# EasyEDA Pro project ProPrj_大功率电调_2026-08-17.epro, board 大功率电调V1.2
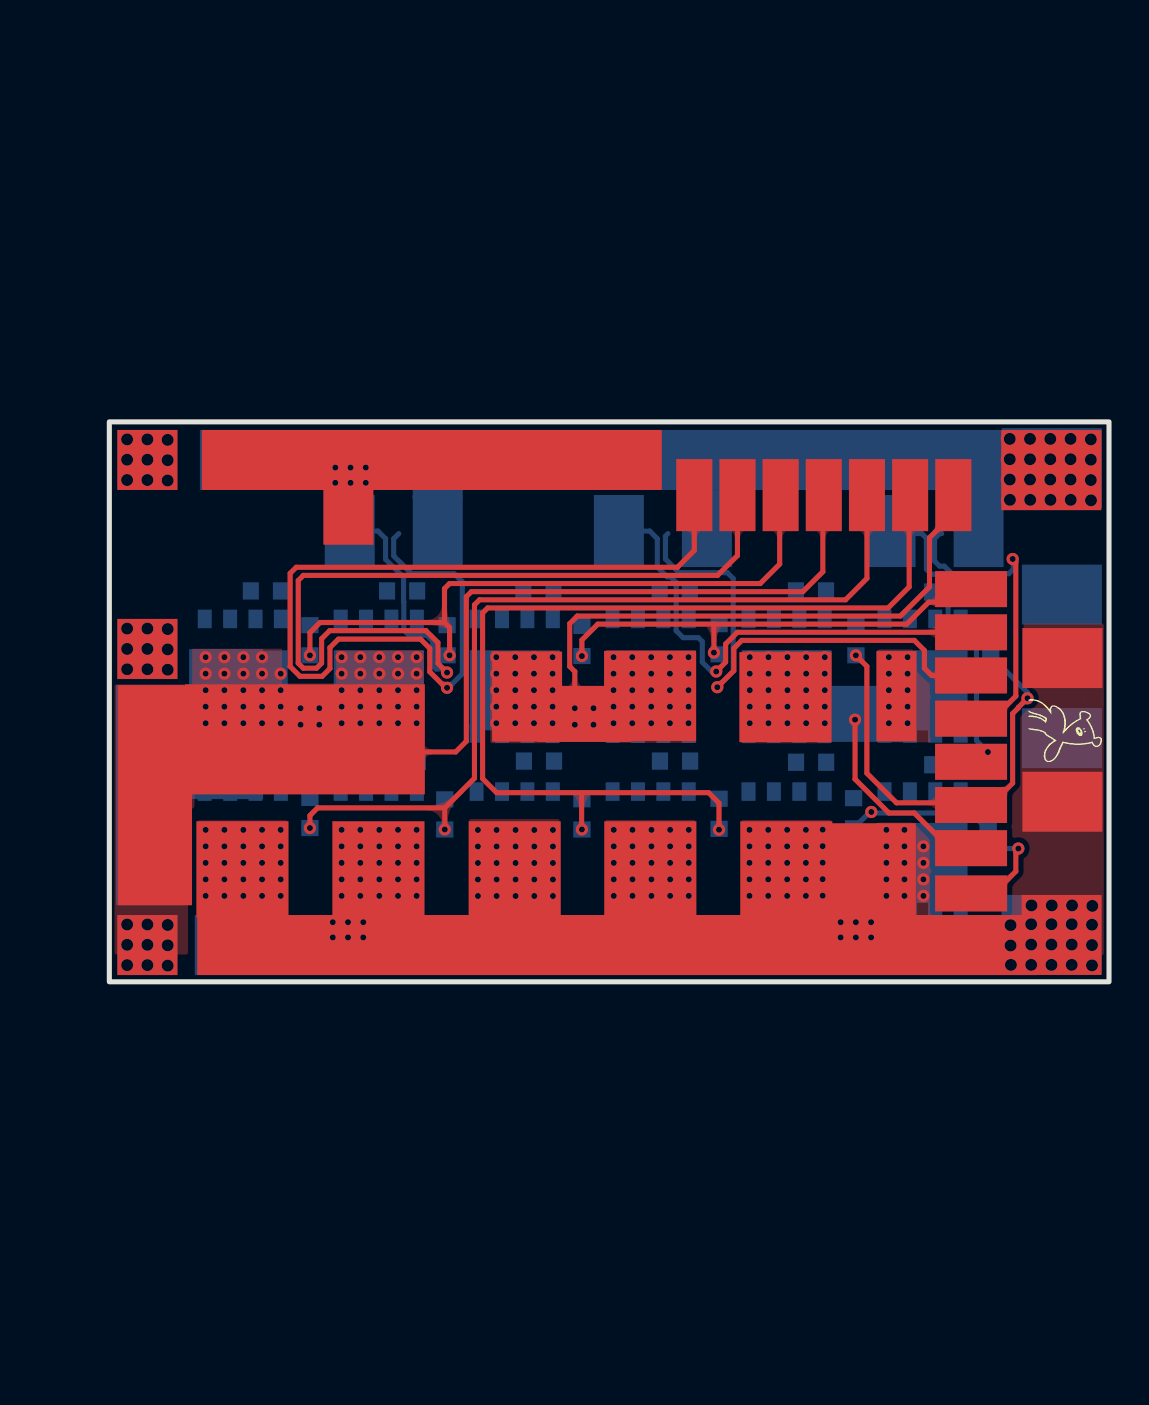
[diagram p17: board, top side]
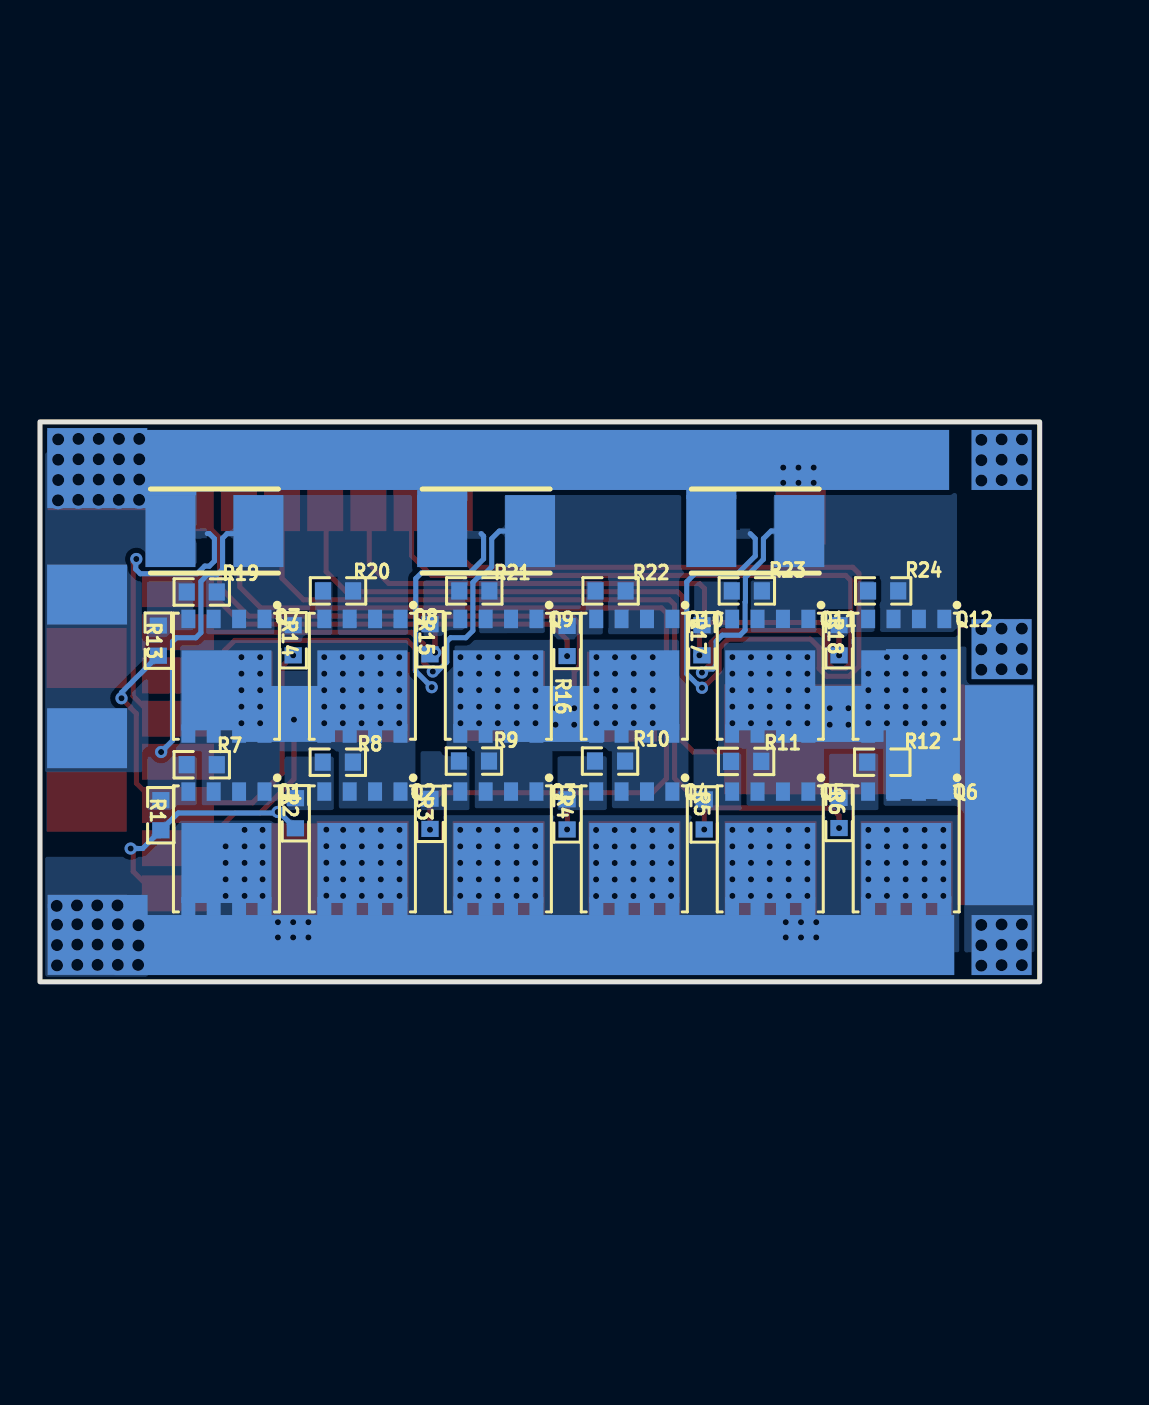
[diagram p18: board, bottom side, seen from below]

Outline 50 x 28 mm; copper layers: Top Layer, Inner1, Inner2, Bottom Layer. Coordinates in mm from the lower left corner of the outline.
Outline path: rectangle 50,28 0,0
Stack: Top Layer 0.035mm Outer layer thickness 1oz / Dielectric1 0.2104mm 7628 RC49% 8.6mil / Inner1 0.0152mm Inner layer thickness / Dielectric2 1.065mm 1.1mm H/HOZ Copper / Inner2 0.0152mm Inner layer thickness / Dielectric3 0.2104mm 7628 RC49% 8.6mil / Bottom Layer 0.035mm Outer layer thickness 1oz

## Design rules (mm)
spacing copperThickness1oz (default): track to track 0.152, other pairs 0.152 to 0.3
spacing copperThickness2oz: track to track 0.203, other pairs 0.152 to 0.3
track width copperThickness1oz (default): min 0.127, default 0.254, max 2.54
track width copperThickness2oz: min 0.203, default 0.254, max 2.54
differential pair differentialPair (default): width min 0.127, default 0.254, max 2.54; gap min 0.152, default 0.152
net GND uses copperRegion
net VCC_BUS uses copperRegion
net U uses copperRegion
net V uses copperRegion
net GHA uses copperRegion
net SNB uses copperRegion

## Placement (name value [footprint] x y rotation side)
CN7  电源正  [单焊盘_贴片_矩形_2X2_1脚#2]  47.12 2.35 90 bottom
CN8  电源负  [单焊盘_贴片_矩形_2X2_1脚#2]  47.14 25.69 90 bottom
CN9  母线电容正  [单焊盘_贴片_矩形_2X2_1脚]  47.67 16.19 270 top
CN10  母线电容正  [单焊盘_贴片_矩形_2X2_1脚]  47.67 9.01 270 top
CN11  母线电容负  [单焊盘_贴片_矩形_2X2_1脚]  47.64 19.36 90 bottom
CN12  母线电容负  [单焊盘_贴片_矩形_2X2_1脚]  47.64 12.18 90 bottom
NOREF  -  [Pad_e304]  43.1 15.32 180 top
NOREF#2  -  [Pad_e734]  27.05 14.29 90 top
NOREF#3  -  [Pad_e885]  37.59 13.4 90 top
NOREF#4  -  [Pad_e751]  33.86 5.63 90 top
NOREF#5  -  [Pad_e314]  37.23 5.57 90 top
NOREF#6  -  [Pad_e300]  43.1 6.68 180 top
NOREF#7  -  [Pad_e745]  39.37 14.28 90 top
NOREF#8  -  [Pad_e744]  20.89 14.26 90 top
NOREF#9  -  [Pad_e821]  5.84 12.89 0 top
NOREF#10  -  [Pad_e883]  24.13 13.4 90 top
NOREF#11  -  [Pad_e753]  20.27 5.63 90 top
NOREF#12  -  [Pad_e302]  43.1 11 180 top
NOREF#13  -  [Pad_e102]  25.53 26.09 270 top
NOREF#14  -  [Pad_e859]  9.78 12.12 90 top
NOREF#15  -  [Pad_e756]  39.34 5.63 90 top
NOREF#16  -  [Pad_e311]  33.58 24.34 90 top
NOREF#17  -  [Pad_e299]  43.11 4.42 180 top
NOREF#18  -  [Pad_e599]  25.4 1.84 270 top
NOREF#19  -  [Pad_e754]  13.46 5.63 90 top
NOREF#20  -  [Pad_e306]  43.1 19.64 180 top
NOREF#21  -  [Pad_e105]  1.9 26.09 270 top
NOREF#22  -  [Pad_e769]  47.12 25.59 90 top
NOREF#23  -  [Pad_e312]  31.42 24.34 90 top
NOREF#24  -  [Pad_e766]  1.9 26.09 90 top
NOREF#25  -  [Pad_e768]  1.9 1.84 90 top
NOREF#26  -  [Pad_e882]  23.75 13.4 90 top
NOREF#27  -  [Pad_e305]  43.1 17.48 180 top
NOREF#28  -  [Pad_e735]  33.81 14.24 90 top
NOREF#29  -  [Pad_e313]  29.26 24.34 90 top
NOREF#30  -  [Pad_e301]  43.1 8.84 180 top
NOREF#31  -  [Pad_e884]  10.16 13.4 90 top
NOREF#32  -  [Pad_e303]  43.1 13.16 180 top
NOREF#33  -  [Pad_e106]  1.9 16.63 270 top
NOREF#34  -  [Pad_e308]  40.05 24.34 90 top
NOREF#35  -  [Pad_e310]  35.73 24.34 90 top
NOREF#36  -  [Pad_e818]  29.88 24.34 270 top
NOREF#37  -  [Pad_e820]  2.03 9.33 0 top
NOREF#38  -  [Pad_e819]  16.42 24.39 270 top
NOREF#39  -  [Pad_e107]  1.9 1.84 270 top
NOREF#40  -  [Pad_e592]  16.13 26.09 270 top
NOREF#41  -  [Pad_e767]  1.9 16.65 90 top
NOREF#42  -  [Pad_e817]  43.43 24.57 270 top
NOREF#43  -  [Pad_e752]  27.06 5.63 90 top
NOREF#44  -  [Pad_e770]  47.62 2.35 90 top
NOREF#45  -  [Pad_e307]  42.21 24.34 90 top
NOREF#46  -  [Pad_e858]  2.29 9.33 0 top
NOREF#47  -  [Pad_e309]  37.89 24.34 90 top
NOREF#48  -  [Pad_e755]  6.66 5.63 90 top
NOREF#49  -  [Pad_e253]  25.27 1.84 270 top
NOREF#50  -  [Pad_e315]  11.96 23.86 270 top
Q1  BSC035N10NS5  [PG-TDSON-8_L5.2-W5.9-P1.27-LS6.2-BL-EP]  40.67 6.65 0 bottom
Q2  BSC035N10NS5  [PG-TDSON-8_L5.2-W5.9-P1.27-LS6.2-BL-EP]  33.88 6.65 0 bottom
Q3  BSC035N10NS5  [PG-TDSON-8_L5.2-W5.9-P1.27-LS6.2-BL-EP]  27.07 6.65 0 bottom
Q4  BSC035N10NS5  [PG-TDSON-8_L5.2-W5.9-P1.27-LS6.2-BL-EP]  20.28 6.65 0 bottom
Q5  BSC035N10NS5  [PG-TDSON-8_L5.2-W5.9-P1.27-LS6.2-BL-EP]  13.48 6.65 0 bottom
Q6  BSC035N10NS5  [PG-TDSON-8_L5.2-W5.9-P1.27-LS6.2-BL-EP]  6.68 6.65 0 bottom
Q7  BSC035N10NS5  [PG-TDSON-8_L5.2-W5.9-P1.27-LS6.2-BL-EP]  40.67 15.28 0 bottom
Q8  BSC035N10NS5  [PG-TDSON-8_L5.2-W5.9-P1.27-LS6.2-BL-EP]  33.88 15.28 0 bottom
Q9  BSC035N10NS5  [PG-TDSON-8_L5.2-W5.9-P1.27-LS6.2-BL-EP]  27.07 15.28 0 bottom
Q10  BSC035N10NS5  [PG-TDSON-8_L5.2-W5.9-P1.27-LS6.2-BL-EP]  20.28 15.28 0 bottom
Q11  BSC035N10NS5  [PG-TDSON-8_L5.2-W5.9-P1.27-LS6.2-BL-EP]  13.48 15.28 0 bottom
Q12  BSC035N10NS5  [PG-TDSON-8_L5.2-W5.9-P1.27-LS6.2-BL-EP]  6.68 15.28 0 bottom
R1  10  [R0603]  43.96 8.33 270 bottom
R2  10  [R0603]  37.22 8.43 270 bottom
R3  10  [R0603]  30.49 8.4 270 bottom
R4  10  [R0603]  23.64 8.37 270 bottom
R5  10  [R0603]  16.78 8.37 270 bottom
R6  10  [R0603]  10.03 8.44 270 bottom
R7  10K  [R0603]  41.91 10.86 0 bottom
R8  10K  [R0603]  35.1 10.98 0 bottom
R9  10K  [R0603]  28.3 11.04 0 bottom
R10  10K  [R0603]  21.49 11.04 0 bottom
R11  10K  [R0603]  14.68 11.02 0 bottom
R12  10K  [R0603]  7.87 10.98 0 bottom
R13  10  [R0603]  44.08 17.06 270 bottom
R14  10  [R0603]  37.34 17.08 270 bottom
R15  10  [R0603]  30.49 17.13 270 bottom
R16  10  [R0603]  23.64 17.04 270 bottom
R17  10  [R0603]  16.89 17.08 270 bottom
R18  10  [R0603]  10.03 17.08 270 bottom
R19  10K  [R0603]  41.91 19.49 0 bottom
R20  10K  [R0603]  35.09 19.55 0 bottom
R21  10K  [R0603]  28.28 19.55 0 bottom
R22  10K  [R0603]  21.46 19.55 0 bottom
R23  10K  [R0603]  14.65 19.55 0 bottom
R24  10K  [R0603]  7.83 19.55 0 bottom
R25  0.5mΩ  [RES-SMD_L6.4-W3.2_RLP25]  27.69 22.54 180 bottom
R26  0.5mΩ  [RES-SMD_L6.4-W3.2_RLP25]  14.22 22.54 180 bottom
R28  0.5mΩ  [RES-SMD_L6.4-W3.2_RLP25]  41.28 22.54 180 bottom

## Footprints (pads in the part's own frame, mm; a bottom-side part is the same pattern mirrored in y, then rotated)
Pad_e102
  rect 3x42 smd far side: 1(0,0)
Pad_e105
  rect 3x3 smd far side: 1(0,0)
Pad_e106
  rect 3x3 smd far side: 1(0,0)
Pad_e107
  rect 3x3 smd far side: 1(0,0)
Pad_e253
  rect 3x42 smd far side: 1(0,0)
Pad_e299
  rect 3.6x1.8 smd: 1(0,0)
Pad_e300
  rect 3.6x1.8 smd: 1(0,0)
Pad_e301
  rect 3.6x1.8 smd: 1(0,0)
Pad_e302
  rect 3.6x1.8 smd: 1(0,0)
Pad_e303
  rect 3.6x1.8 smd: 1(0,0)
Pad_e304
  rect 3.6x1.8 smd: 1(0,0)
Pad_e305
  rect 3.6x1.8 smd: 1(0,0)
Pad_e306
  rect 3.6x1.8 smd: 1(0,0)
Pad_e307
  rect 3.6x1.8 smd: 1(0,0)
Pad_e308
  rect 3.6x1.8 smd: 1(0,0)
Pad_e309
  rect 3.6x1.8 smd: 1(0,0)
Pad_e310
  rect 3.6x1.8 smd: 1(0,0)
Pad_e311
  rect 3.6x1.8 smd: 1(0,0)
Pad_e312
  rect 3.6x1.8 smd: 1(0,0)
Pad_e313
  rect 3.6x1.8 smd: 1(0,0)
Pad_e314
  rect 4.7x2.5 smd: 1(0,0)
Pad_e315
  rect 4x2.5 smd: 1(0,0)
Pad_e592
  rect 3x23 smd: 1(0,0)
Pad_e599
  rect 3x42 smd: 1(0,0)
Pad_e734
  rect 4.5x4.6 smd: 1(0,0)
Pad_e735
  rect 4.5x4.6 smd: 1(0,0)
Pad_e744
  rect 4.5x3.5 smd: 1(0,0)
Pad_e745
  rect 4.5x2 smd: 1(0,0)
Pad_e751
  rect 4.8x4.6 smd: 1(0,0)
Pad_e752
  rect 4.8x4.6 smd: 1(0,0)
Pad_e753
  rect 4.8x4.6 smd: 1(0,0)
Pad_e754
  rect 4.8x4.6 smd: 1(0,0)
Pad_e755
  rect 4.8x4.6 smd: 1(0,0)
Pad_e756
  rect 4.6x2 smd: 1(0,0)
Pad_e766
  rect 3x3 smd: 1(0,0)
Pad_e767
  rect 3x3 smd: 1(0,0)
Pad_e768
  rect 3x3 smd: 1(0,0)
Pad_e769
  rect 4x5 smd: 1(0,0)
Pad_e770
  rect 4x4 smd: 1(0,0)
Pad_e817
  rect 0.5x2.5 smd far side: 1(0,0)
Pad_e818
  rect 0.5x2.5 smd far side: 1(0,0)
Pad_e819
  rect 0.5x2.5 smd far side: 1(0,0)
Pad_e820
  rect 3.4x11 smd far side: 1(0,0)
Pad_e821
  rect 3.7x7.5 smd far side: 1(0,0)
Pad_e858
  rect 3.7x11 smd: 1(0,0)
Pad_e859
  rect 5.5x12 smd: 1(0,0)
Pad_e882
  rect 2.8x4.7 smd: 1(0,0)
Pad_e883
  rect 2.8x4.7 smd far side: 1(0,0)
Pad_e884
  rect 2.8x4.7 smd far side: 1(0,0)
Pad_e885
  rect 2.8x4.7 smd far side: 1(0,0)
PG-TDSON-8_L5.2-W5.9-P1.27-LS6.2-BL-EP
  rect 0.7x0.925 smd: 1(-1.905,-2.865) 2(-0.635,-2.865) 3(0.635,-2.865) 4(1.905,-2.865) 5(1.905,2.865) 6(0.635,2.865) 7(-0.635,2.865) 8(-1.905,2.865)
  rect 4.5x4 smd: 9(0.001,0.705)
R0603
  rect 0.806x0.864 smd: 1(-0.753,0) 2(0.753,0)
RES-SMD_L6.4-W3.2_RLP25
  rect 2.5x3.6 smd: 1(-2.2,0) 2(2.2,0)
单焊盘_贴片_矩形_2X2_1脚
  rect 3x4 smd: 1(0,0)
单焊盘_贴片_矩形_2X2_1脚#2
  rect 4x5 smd: 1(0,0)

## Nets
GND: CN8.1 CN11.1 CN12.1 NOREF#13.1 NOREF#22.1 NOREF#36.1 NOREF#38.1 NOREF#40.1 NOREF#42.1 NOREF#50.1 R25.1 R26.1 R28.1
VCC_BUS: CN7.1 CN9.1 CN10.1 NOREF#4.1 NOREF#5.1 NOREF#11.1 NOREF#15.1 NOREF#18.1 NOREF#19.1 NOREF#43.1 NOREF#44.1 NOREF#48.1 NOREF#49.1 Q1.5 Q1.6 Q1.7 Q1.8 Q1.9 Q2.5 Q2.6 Q2.7 Q2.8 Q2.9 Q3.5 Q3.6 Q3.7 Q3.8 Q3.9 Q4.5 Q4.6 Q4.7 Q4.8 Q4.9 Q5.5 Q5.6 Q5.7 Q5.8 Q5.9 Q6.5 Q6.6 Q6.7 Q6.8 Q6.9
GHA: NOREF#17.1 R1.2 R2.2
GHB: NOREF#34.1 R3.2 R4.2
GHC: NOREF#47.1 R5.2 R6.2
GLA: NOREF#30.1 R13.2 R14.2
GLB: NOREF#20.1 R15.2 R16.2
GLC: NOREF#16.1 R17.2 R18.2
SNA: NOREF#32.1
SNB: NOREF.1
SNC: NOREF#29.1
SPA: NOREF#12.1 Q7.1 Q7.2 Q7.3 Q8.1 Q8.2 Q8.3 R19.1 R20.1 R28.2
SPB: NOREF#27.1 Q9.1 Q9.2 Q9.3 Q10.1 Q10.2 Q10.3 R21.1 R22.1 R25.2
SPC: NOREF#23.1 Q11.1 Q11.2 Q11.3 Q12.1 Q12.2 Q12.3 R23.1 R24.1 R26.2
U: NOREF#3.1 NOREF#6.1 NOREF#7.1 NOREF#21.1 NOREF#24.1 NOREF#28.1 Q1.1 Q1.2 Q1.3 Q2.1 Q2.2 Q2.3 Q7.5 Q7.6 Q7.7 Q7.8 Q7.9 Q8.5 Q8.6 Q8.7 Q8.8 Q8.9 R7.1 R8.1
V: NOREF#2.1 NOREF#8.1 NOREF#10.1 NOREF#26.1 NOREF#33.1 NOREF#41.1 NOREF#45.1 Q3.1 Q3.2 Q3.3 Q4.1 Q4.2 Q4.3 Q9.5 Q9.6 Q9.7 Q9.8 Q9.9 Q10.5 Q10.6 Q10.7 Q10.8 Q10.9 R9.1 R10.1
W: NOREF#9.1 NOREF#14.1 NOREF#25.1 NOREF#31.1 NOREF#35.1 NOREF#37.1 NOREF#39.1 NOREF#46.1 Q5.1 Q5.2 Q5.3 Q6.1 Q6.2 Q6.3 Q11.5 Q11.6 Q11.7 Q11.8 Q11.9 Q12.5 Q12.6 Q12.7 Q12.8 Q12.9 R11.1 R12.1
$1N249: Q1.4 R1.1 R7.2
$1N251: Q2.4 R2.1 R8.2
$1N253: Q7.4 R13.1 R19.2
$1N255: Q8.4 R14.1 R20.2
$1N257: Q9.4 R15.1 R21.2
$1N259: Q3.4 R3.1 R9.2
$1N261: Q10.4 R16.1 R22.2
$1N263: Q4.4 R4.1 R10.2
$1N265: Q11.4 R17.1 R23.2
$1N267: Q5.4 R5.1 R11.2
$1N269: Q12.4 R18.1 R24.2
$1N271: Q6.4 R6.1 R12.2

## Via types
v1: diameter 0.9, hole 0.6, Top Layer to Bottom Layer, 66 vias
v2: diameter 0.61, hole 0.305, Top Layer to Bottom Layer, 313 vias

## Routing (per net, layer and track width the routed paths; a pad name or vN(x,y) marks a point on that pad's centre or on a via; arc(x,y) is an arc through that point)
GND:
  vias: v1(45.04,27.15) v1(45.04,26.13) v1(45.04,25.12) v1(45.04,24.1) v1(46.05,27.15) v1(46.05,26.13) v1(46.05,25.12) v1(46.06,24.1) v1(47.06,27.15) v1(47.06,26.13) v1(47.06,25.12) v1(47.07,24.1) v1(48.08,27.15) v1(48.08,26.13) v1(48.08,25.12) v1(48.09,24.1) v1(49.09,27.12) v1(49.09,26.11) v1(49.09,25.09) v1(49.1,24.08) v2(11.3,25.71) v2(11.3,24.95) v2(12.06,25.71) v2(12.06,24.95) v2(12.83,25.71) v2(12.83,24.95)
VCC_BUS:
  vias: v1(45.08,2.83) v1(45.08,1.81) v1(45.09,0.85) v1(46.12,3.82) v1(46.11,2.88) v1(46.11,1.86) v1(46.11,0.85) v1(47.14,3.82) v1(47.12,2.88) v1(47.12,1.86) v1(47.12,0.85) v1(48.15,3.82) v1(48.13,2.88) v1(48.13,1.86) v1(48.13,0.85) v1(49.16,3.8) v1(49.15,2.85) v1(49.15,1.84) v1(49.15,0.82) v2(4.82,7.6) v2(4.82,6.77) v2(4.82,5.95) v2(4.82,5.12) v2(4.82,4.3) v2(5.75,7.6) v2(5.75,6.77) v2(5.75,5.95) v2(5.75,5.12) v2(5.75,4.3) v2(6.7,7.6) v2(6.7,6.77) v2(6.7,5.95) v2(6.7,5.12) v2(6.7,4.3) v2(7.64,7.6) v2(7.64,6.77) v2(7.64,5.95) v2(7.64,5.12) v2(7.64,4.3) v2(8.57,7.6) v2(8.57,6.77) v2(8.57,5.95) v2(8.57,5.12) v2(8.57,4.3) v2(11.18,2.98) v2(11.18,2.22) v2(11.62,7.6) v2(11.62,6.77) v2(11.62,5.95) v2(11.62,5.12) v2(11.62,4.3) v2(11.94,2.98) v2(11.94,2.22) v2(12.55,7.6) v2(12.55,6.77) v2(12.55,5.95) v2(12.55,5.12) v2(12.55,4.3) v2(12.7,2.98) v2(12.7,2.22) v2(13.5,7.6) v2(13.5,6.77) v2(13.5,5.95) v2(13.5,5.12) v2(13.5,4.3) v2(14.44,7.6) v2(14.44,6.77) v2(14.44,5.95) v2(14.44,5.12) v2(14.44,4.3) v2(15.37,7.6) v2(15.37,6.77) v2(15.37,5.95) v2(15.37,5.12) v2(15.37,4.3) v2(18.43,7.59) v2(18.43,6.77) v2(18.43,5.94) v2(18.43,5.12) v2(18.43,4.29) v2(19.37,7.59) v2(19.37,6.77) v2(19.37,5.94) v2(19.37,5.12) v2(19.37,4.29) v2(20.32,7.59) v2(20.32,6.77) v2(20.32,5.94) v2(20.32,5.12) v2(20.32,4.29) v2(21.26,7.59) v2(21.26,6.77) v2(21.26,5.94) v2(21.26,5.12) v2(21.26,4.29) v2(22.19,7.59) v2(22.19,6.77) v2(22.19,5.94) v2(22.19,5.12) v2(22.19,4.29) v2(25.23,7.6) v2(25.23,6.77) v2(25.23,5.95) v2(25.23,5.12) v2(25.23,4.3) v2(26.17,7.6) v2(26.17,6.77) v2(26.17,5.95) v2(26.17,5.12) v2(26.17,4.3) v2(27.11,7.6) v2(27.11,6.77) v2(27.11,5.95) v2(27.11,5.12) v2(27.11,4.3) v2(28.05,7.6) v2(28.05,6.77) v2(28.05,5.95) v2(28.05,5.12) v2(28.05,4.3) v2(28.98,7.6) v2(28.98,6.77) v2(28.98,5.95) v2(28.98,5.12) v2(28.98,4.3) v2(32.02,7.6) v2(32.02,6.77) v2(32.02,5.95) v2(32.02,5.12) v2(32.02,4.3) v2(32.95,7.6) v2(32.95,6.77) v2(32.95,5.95) v2(32.95,5.12) v2(32.95,4.3) v2(33.9,7.6) v2(33.9,6.77) v2(33.9,5.95) v2(33.9,5.12) v2(33.9,4.3) v2(34.84,7.6) v2(34.84,6.77) v2(34.84,5.95) v2(34.84,5.12) v2(34.84,4.3) v2(35.68,7.61) v2(35.68,6.78) v2(35.68,5.96) v2(35.68,5.13) v2(35.68,4.31) v2(36.58,2.98) v2(36.58,2.22) v2(37.34,2.98) v2(37.34,2.22) v2(38.1,2.98) v2(38.1,2.22) v2(38.87,7.6) v2(38.87,6.77) v2(38.87,5.95) v2(38.87,5.12) v2(38.87,4.3) v2(39.77,7.6) v2(39.77,6.77) v2(39.77,5.95) v2(39.77,5.12) v2(39.77,4.3) v2(40.72,6.77) v2(40.72,5.95) v2(40.72,5.12) v2(40.72,4.3)
GHA: length 13.2
  Top Layer w0.254: v2(45.47,6.66) 45.34,6.54 45.34,5.52 44.24,4.42 NOREF#17.1
  Bottom Layer w0.254: R2.2 38.04,8.49 v2(38.11,8.49) 38.16,8.44 43.09,8.44 R1.2 44.87,6.66 v2(45.47,6.66)
GHB: length 50.3
  Top Layer w0.254: v2(23.64,7.62) 23.62,7.63 23.62,9.46 ; NOREF#34.1 40,24.29 40,19.75 38.96,18.7 18.92,18.7 18.67,18.44 18.67,10.16 19.37,9.46 23.62,9.46 ; 23.62,9.46 29.97,9.46 30.49,8.94 v2(30.49,7.61)
GHC: length 43.7
  Top Layer w0.254: 16.78,8.7 v2(16.78,7.62) ; 16.78,8.7 18.26,10.18 18.26,18.85 18.52,19.1 36.82,19.1 37.89,20.17 NOREF#47.1 ; 16.78,8.7 10.41,8.7 10.03,8.31 v2(10.03,7.69)
GLA: length 22
  Top Layer w0.254: v2(45.92,14.18) 45.47,13.72 45.47,13.7 45.18,13.41 45.18,9.93 44.09,8.84 NOREF#30.1 42.99,8.95 39.37,8.95 37.89,10.43 37.89,15.77 v2(37.34,16.32)
  Bottom Layer w0.254: R13.2 45.92,14.47 v2(45.92,14.18)
GLB: length 22.7
  Top Layer w0.254: 30.24,17.88 39.88,17.88 40.98,18.98 42.45,18.98 NOREF#20.1 ; 30.24,17.88 24.43,17.88 23.64,17.09 v2(23.64,16.29) ; 30.24,17.88 v2(30.24,16.46)
GLC: length 32.3
  Top Layer w0.254: v2(17.02,16.32) 17.02,17.71 16.76,17.97 ; NOREF#16.1 33.53,24.29 33.53,20.89 32.56,19.92 17.02,19.92 16.76,19.66 16.76,17.97 ; 16.76,17.97 10.54,17.97 10.03,17.46 v2(10.03,16.32)
SNA: length 16
  Top Layer w0.254: NOREF#32.1 44.21,13.16 45.34,14.28 45.34,20.98 v2(45.18,21.14)
  Bottom Layer w0.254: v2(45.18,21.14) 45.21,21.11 45.21,20.63 44.98,20.41 42.14,20.41 41.76,20.79 41.53,20.79 41.28,21.04 41.28,22.16 41.53,22.41 41.63,22.41
SNB: length 26.4
  Top Layer w0.254: v2(30.41,14.73) 31.24,15.56 31.24,16.67 31.63,17.07 40.27,17.07 40.77,16.57 40.77,15.68 41.13,15.32 NOREF.1
  Bottom Layer w0.254: 27.94,22.41 27.81,22.28 27.81,21.14 28.5,20.46 30.91,20.46 31.2,20.16 31.2,15.53 v2(30.41,14.73)
SNC: length 50.1
  Top Layer w0.254: NOREF#29.1 29.26,21.57 28.42,20.73 9.35,20.73 9.04,20.42 9.04,15.77 9.53,15.27 10.64,15.27 11.03,15.67 11.03,16.71 11.46,17.13 15.57,17.13 16.03,16.67 16.03,15.5 16.65,14.88 16.71,14.88 v2(16.89,14.7)
  Bottom Layer w0.254: 14.48,22.41 14.22,22.16 14.22,21.29 15.11,20.41 17.25,20.41 17.65,20 17.65,15.4 17.13,14.88 17.07,14.88 v2(16.89,14.7)
SPA: length 14.8
  Bottom Layer w0.254: v2(43.94,11.49) 43.37,12.06 43.37,17.01 43.18,17.2 42.2,17.2 41.95,17.46 41.95,20.02 41.59,20.38 41.12,20.38 40.87,20.63 40.87,22.18 40.64,22.41 39.2,22.41 R28.2
SPB: length 24.7
  Top Layer w0.254: v2(30.35,15.52) 30.82,15.99 30.82,16.89 31.41,17.48 NOREF#27.1
  Bottom Layer w0.254: v2(30.35,15.52) 30.12,15.52 29.66,15.98 29.66,17.01 29.46,17.2 28.7,17.2 28.35,17.56 28.35,19.97 28.07,20.25 27.9,20.25 27.41,20.75 27.41,22.16 27.03,22.54 25.49,22.54
SPC: length 50.8
  Top Layer w0.254: NOREF#23.1 31.42,21.32 30.42,20.32 9.7,20.32 9.45,20.07 9.45,15.94 9.7,15.68 10.36,15.68 10.62,15.94 10.62,17.15 11.02,17.56 15.83,17.56 16.43,16.96 16.43,15.92 v2(16.89,15.46)
  Bottom Layer w0.254: v2(16.89,15.46) 16.71,15.64 16.34,15.64 16.18,15.81 16.18,17.03 15.88,17.33 14.99,17.33 14.73,17.59 14.73,18.98 14.72,19 14.72,20.23 13.82,21.13 13.82,22.16 13.44,22.54 R26.2
U: length 10.2
  Top Layer w0.254: v2(37.3,13.11) 37.3,10.13 38.99,8.44 40.26,8.44 42.02,6.68 NOREF#6.1
  vias: v1(0.89,27.12) v1(0.89,26.11) v1(0.89,25.09) v1(1.9,27.12) v1(1.9,26.11) v1(1.9,25.09) v1(2.92,27.1) v1(2.92,26.08) v1(2.92,25.07) v2(32.03,16.23) v2(32.03,15.41) v2(32.03,14.58) v2(32.03,13.76) v2(32.03,12.93) v2(32.97,16.23) v2(32.97,15.41) v2(32.97,14.58) v2(32.97,13.76) v2(32.97,12.93) v2(33.92,16.23) v2(33.92,15.41) v2(33.92,14.58) v2(33.92,13.76) v2(33.92,12.93) v2(34.85,16.23) v2(34.85,15.41) v2(34.85,14.58) v2(34.85,13.76) v2(34.85,12.93) v2(35.78,16.23) v2(35.78,15.41) v2(35.78,14.58) v2(35.78,13.76) v2(35.78,12.93) v2(38.99,16.23) v2(38.99,15.41) v2(38.99,14.58) v2(38.99,13.76) v2(38.99,12.93) v2(39.93,16.23) v2(39.93,15.41) v2(39.93,14.58) v2(39.93,13.76) v2(39.93,12.93)
V: length 28.2
  Top Layer w0.254: NOREF#45.1 42.29,24.26 42.29,23.48 41.02,22.21 41.02,19.75 39.57,18.29 23.41,18.29 23.03,17.91 23.03,15.77 23.28,15.51 v2(23.28,13.68)
  vias: v1(0.89,17.66) v1(0.89,16.65) v1(0.89,15.63) v1(1.9,17.66) v1(1.9,16.65) v1(1.9,15.63) v1(2.92,17.64) v1(2.92,16.62) v1(2.92,15.61) v2(19.35,16.23) v2(19.35,15.41) v2(19.35,14.58) v2(19.35,13.76) v2(19.35,12.93) v2(20.3,16.23) v2(20.3,15.41) v2(20.3,14.58) v2(20.3,13.76) v2(20.3,12.93) v2(21.24,16.23) v2(21.24,15.41) v2(21.24,14.58) v2(21.24,13.76) v2(21.24,12.93) v2(22.17,16.23) v2(22.17,15.41) v2(22.17,14.58) v2(22.17,13.76) v2(22.17,12.93) v2(23.28,12.86) v2(24.22,13.68) v2(24.22,12.86) v2(25.22,16.23) v2(25.22,15.41) v2(25.22,14.58) v2(25.22,13.76) v2(25.22,12.93) v2(26.15,16.23) v2(26.15,15.41) v2(26.15,14.58) v2(26.15,13.76) v2(26.15,12.93) v2(27.1,16.23) v2(27.1,15.41) v2(27.1,14.58) v2(27.1,13.76) v2(27.1,12.93) v2(28.04,16.23) v2(28.04,15.41) v2(28.04,14.58) v2(28.04,13.76) v2(28.04,12.93) v2(28.97,16.23) v2(28.97,15.41) v2(28.97,14.58) v2(28.97,13.76) v2(28.97,12.93)
W: length 38.1
  Top Layer w0.254: NOREF#35.1 35.69,24.29 35.69,20.51 34.69,19.51 18.11,19.51 17.86,19.26 17.86,12.03 17.32,11.49 10.87,11.49 10.5,11.86 v2(10.5,12.86)
  vias: v1(0.89,2.87) v1(0.89,1.85) v1(0.89,0.83) v1(1.9,2.87) v1(1.9,1.85) v1(1.9,0.83) v1(2.92,2.84) v1(2.92,1.83) v1(2.92,0.81) v2(4.82,16.23) v2(4.82,15.41) v2(4.82,14.58) v2(4.82,13.76) v2(4.82,12.93) v2(5.75,16.23) v2(5.75,15.41) v2(5.75,14.58) v2(5.75,13.76) v2(5.75,12.93) v2(6.7,16.23) v2(6.7,15.41) v2(6.7,14.58) v2(6.7,13.76) v2(6.7,12.93) v2(7.64,16.23) v2(7.64,15.41) v2(7.64,14.58) v2(7.64,13.76) v2(7.64,12.93) v2(8.57,15.41) v2(8.57,14.58) v2(8.57,13.76) v2(8.57,12.93) v2(9.56,13.68) v2(9.56,12.86) v2(10.5,13.68) v2(11.62,16.23) v2(11.62,15.41) v2(11.62,14.58) v2(11.62,13.76) v2(11.62,12.93) v2(12.55,16.23) v2(12.55,15.41) v2(12.55,14.58) v2(12.55,13.76) v2(12.55,12.93) v2(13.5,16.23) v2(13.5,15.41) v2(13.5,14.58) v2(13.5,13.76) v2(13.5,12.93) v2(14.44,16.23) v2(14.44,15.41) v2(14.44,14.58) v2(14.44,13.76) v2(14.44,12.93) v2(15.37,16.23) v2(15.37,15.41) v2(15.37,14.58) v2(15.37,13.76) v2(15.37,12.93)

## Copper pours and planes (outline as drawn; the poured copper is in the pictures)
GND on Bottom Layer: 30.84,26.27 30.84,20.46 28.68,20.46 28.68,26.27
GND on Bottom Layer: 50,26.48 50,10.47 44.58,10.47 44.58,26.48
GND on Bottom Layer: 44.83,26.22 44.83,20.68 43.87,20.68 43.87,26.22
GND on Bottom Layer: 17.49,26.34 17.49,20.54 15.21,20.54 15.21,26.34
GND on Bottom Layer: 44.45,26.22 44.45,20.41 42.16,20.41 42.16,26.22
VCC_BUS on Top Layer: 36.13,8.09 36.13,3.2 31.6,3.2 31.6,8.09
VCC_BUS on Top Layer: 22.52,8.14 22.52,3.24 17.99,3.24 17.99,8.14
VCC_BUS on Top Layer: 29.33,8.09 29.33,3.2 24.79,3.2 24.79,8.09
VCC_BUS on Top Layer: 42.94,7.96 42.94,3.06 38.41,3.06 38.41,7.96
VCC_BUS on Top Layer: 8.92,8.08 8.92,3.3 4.39,3.3 4.39,8.08
VCC_BUS on Top Layer: 15.72,8.01 15.72,3.24 11.19,3.24 11.19,8.01
VCC_BUS on Top Layer: 50,17.91 50,1.33 45.08,1.33 45.08,17.91
VCC_BUS on Top Layer: 38.41,7.54 38.41,1.84 36.07,1.84 36.07,7.54
VCC_BUS on Bottom Layer: 50,6.26 50,0.08 44.59,0.08 44.59,6.26
VCC_BUS on Bottom Layer: 44.89,8.33 44.89,1.48 4.03,1.48 4.03,8.33
SPA on Bottom Layer: 31.15,18.51 31.24,18.6 31.24,24.39 40.29,24.39 40.29,20.14 41.69,20.15 41.69,17.38 38.27,17.39 38.27,18.58 36.48,18.58 36.48,20.26 35.11,20.26 35.11,17.33 31.24,17.33 31.15,17.42
SPB on Bottom Layer: 17.63,18.56 17.72,18.65 17.72,24.44 26.77,24.44 26.77,20.06 28.04,20.07 28.04,17.43 24.75,17.44 24.75,18.63 22.96,18.63 22.96,20.31 21.59,20.31 21.59,17.38 17.72,17.38 17.63,17.47
SPC on Bottom Layer: 4.04,18.56 4.13,18.65 4.13,24.44 13.31,24.44 13.31,20.06 14.45,20.07 14.45,17.43 11.16,17.44 11.16,18.63 9.37,18.63 9.37,20.31 8,20.31 8,17.38 4.13,17.38 4.04,17.47
U on Top Layer: 42.92,16.62 42.92,11.98 38.39,11.98 38.39,16.62
U on Top Layer: 36.12,16.57 36.12,11.93 31.59,11.93 31.59,16.57
U on Bottom Layer: 43.33,17.06 43.33,11.52 41.91,11.52 41.91,8.66 38.02,8.66 38.02,11.51 35.08,11.51 35.05,11.49 35.05,8.66 31.22,8.66 31.22,17.33 31.46,17.09 36.63,17.09 36.63,15.55 38.02,15.55 38.02,17 38.1,17.08 43.31,17.08
U on Inner1: 50,28 50,-0.05 0,-0.05 0,28
U on Inner1: 3.43,26.09 3.43,23.05 0.38,23.05 0.38,26.09
V on Top Layer: 29.36,16.59 29.36,11.95 24.83,11.95 24.83,16.59
V on Top Layer: 22.55,16.57 22.55,11.93 18.02,11.93 18.02,16.57
V on Bottom Layer: 29.67,17.08 29.67,11.53 28.26,11.53 28.26,8.68 24.37,8.68 24.37,11.53 21.42,11.53 21.4,11.51 21.4,8.68 17.57,8.68 17.57,17.35 17.81,17.11 22.98,17.11 22.98,15.57 24.37,15.57 24.37,17.02 24.45,17.1 29.65,17.1
V on Inner2: 50,28 50,-0.05 0,-0.05 0,28
W on Top Layer: 0,14.88 4.26,14.88 4.26,8.67 3.94,8.67 3.94,1.36 3.54,1.37 0,1.37
W on Top Layer: 4.15,16.66 15.73,16.66 15.73,11.95 4.15,11.95
W on Bottom Layer: 16.08,17.2 16.08,11.66 14.67,11.66 14.67,8.81 10.78,8.81 10.78,11.66 7.83,11.66 7.81,11.64 7.81,8.81 3.98,8.81 3.98,17.48 4.22,17.24 9.39,17.24 9.39,15.7 10.78,15.7 10.78,17.15 10.86,17.22 16.06,17.22
W on Bottom Layer: 0,16.76 4.26,16.76 4.26,8.78 3.94,8.78 3.94,1.47 3.54,1.48 0,1.48
$1N249 on Bottom Layer: 41.91,11.51 41.93,11.49 44.58,11.49 44.62,11.45 44.62,8.33 41.91,8.33
$1N251 on Bottom Layer: 35.21,11.59 35.23,11.56 37.88,11.56 37.92,11.52 37.92,8.4 35.21,8.4
$1N253 on Bottom Layer: 41.94,20.42 41.96,20.4 44.61,20.4 44.65,20.36 44.65,17.24 41.94,17.24
$1N255 on Bottom Layer: 35.23,20.17 35.25,20.15 37.89,20.15 37.94,20.11 37.94,16.99 35.23,16.99
$1N257 on Bottom Layer: 28.31,20.48 28.33,20.45 30.97,20.45 31.02,20.41 31.02,17.3 28.31,17.3
$1N259 on Bottom Layer: 28.48,11.56 28.5,11.54 31.14,11.54 31.19,11.49 31.19,8.38 28.48,8.38
$1N261 on Bottom Layer: 21.62,20.3 21.64,20.27 24.29,20.27 24.33,20.23 24.33,17.11 21.62,17.11
$1N263 on Bottom Layer: 21.57,11.63 21.59,11.61 24.24,11.61 24.28,11.57 24.28,8.45 21.57,8.45
$1N265 on Bottom Layer: 14.88,20.56 14.9,20.53 17.54,20.53 17.59,20.49 17.59,17.37 14.88,17.37
$1N267 on Bottom Layer: 14.77,11.67 14.8,11.65 17.44,11.65 17.48,11.61 17.48,8.49 14.77,8.49
$1N269 on Bottom Layer: 8.04,20.45 8.07,20.42 10.71,20.42 10.75,20.38 10.75,17.26 8.04,17.26
$1N271 on Bottom Layer: 7.92,11.68 7.94,11.66 10.58,11.66 10.63,11.62 10.63,8.5 7.92,8.5

Small or netless copper shapes (teardrops, artwork), in the pictures only: 39 on Top Layer, 22 on Bottom Layer
